# EAGLE design Garlic220 (EAGLE 9.3.0)
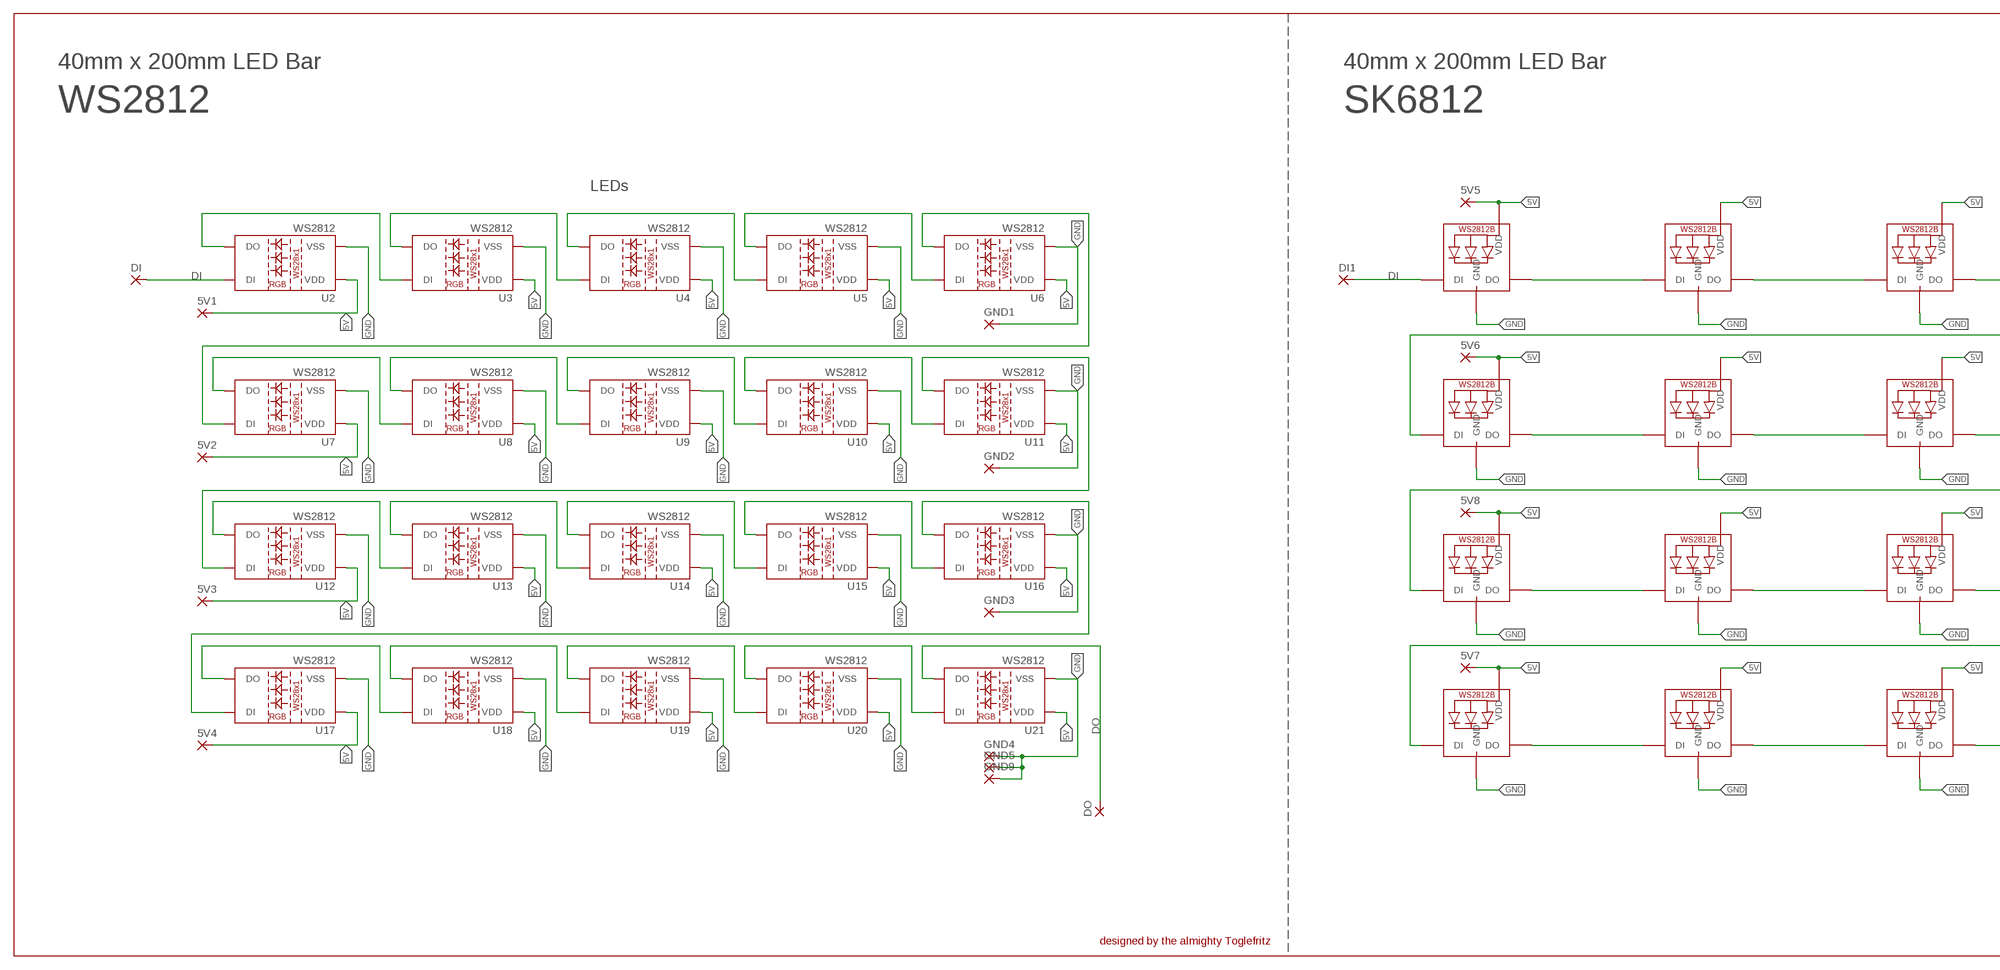
[diagram p0: schematic, sheet 1, part 1 of 2]
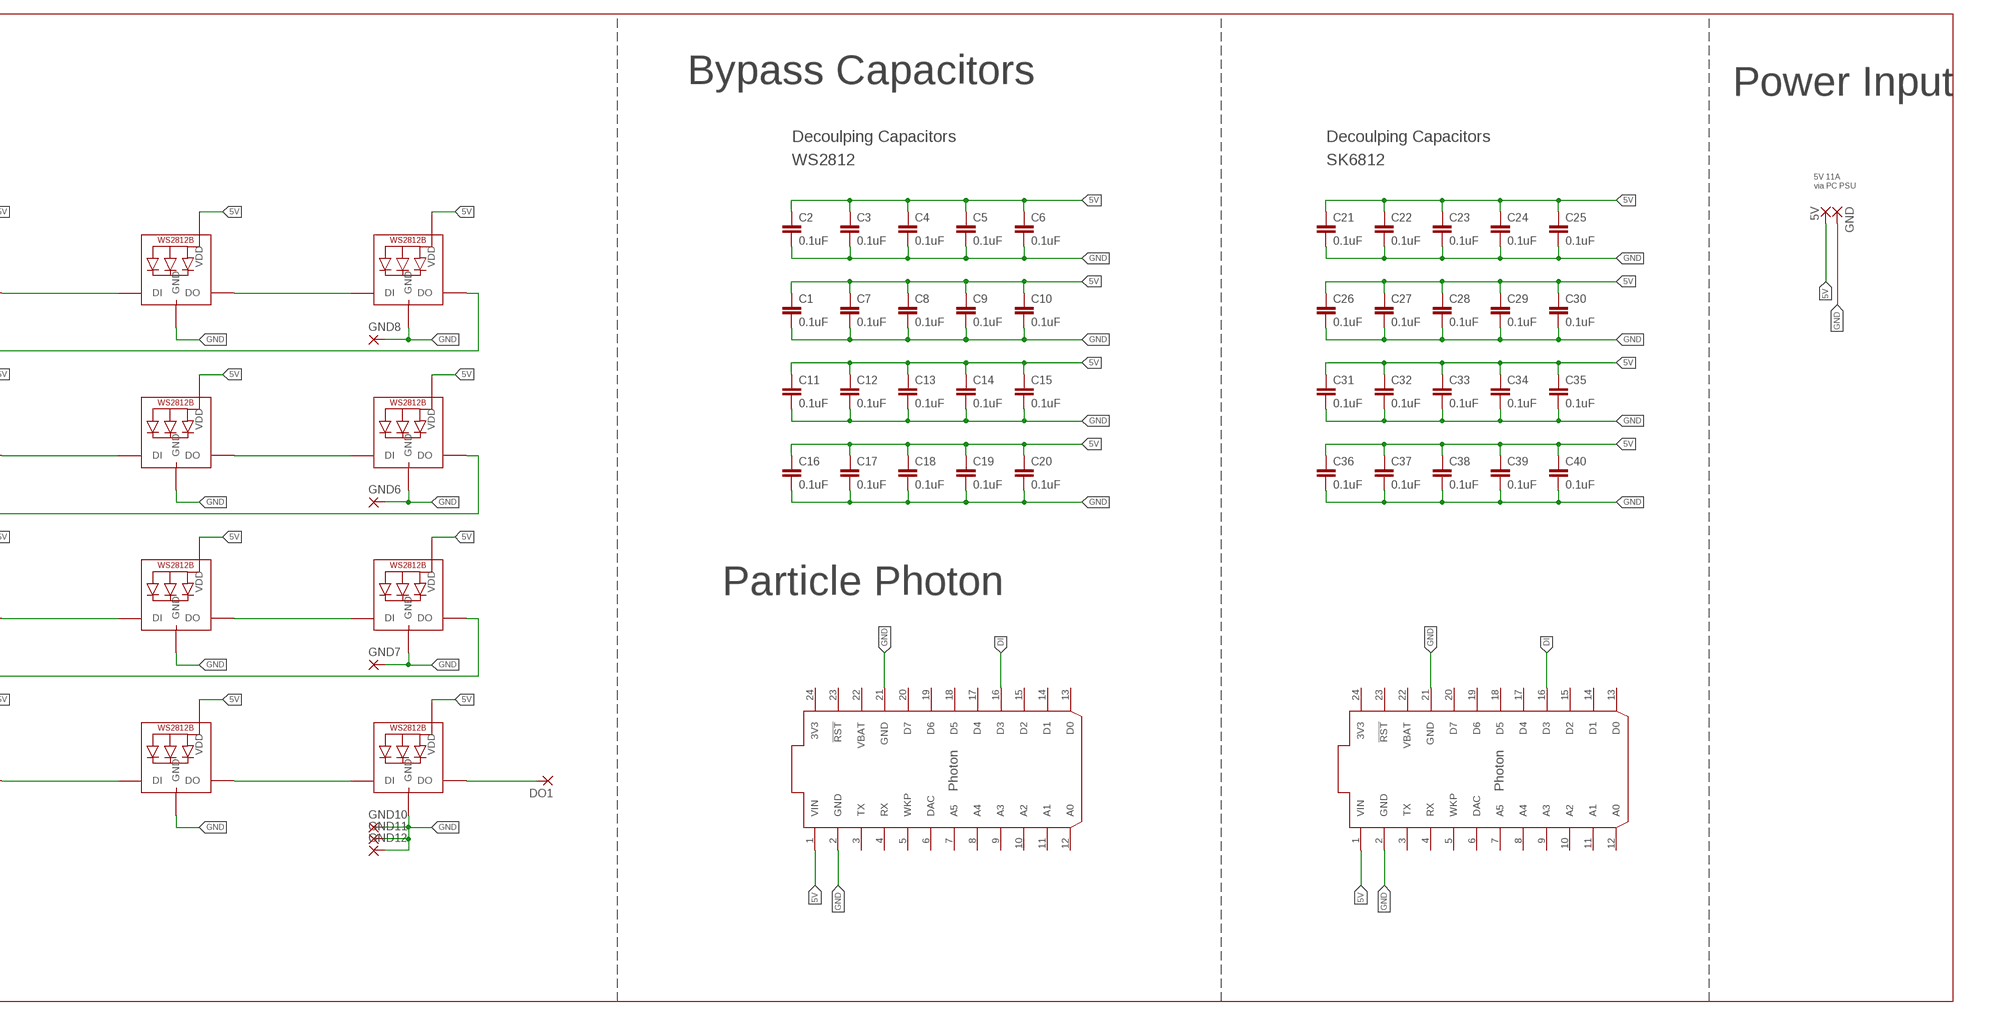
[diagram p1: schematic, sheet 1, part 2 of 2]

## Parts
5V  3,81/1,1  [3,81/1,1]
5V1  SMD5  [SMD2,54-5,08]
5V2  SMD5  [SMD2,54-5,08]
5V3  SMD5  [SMD2,54-5,08]
5V4  SMD5  [SMD2,54-5,08]
5V5  SMD5  [SMD2,54-5,08]
5V6  SMD5  [SMD2,54-5,08]
5V7  SMD5  [SMD2,54-5,08]
5V8  SMD5  [SMD2,54-5,08]
C1  0.1uF  1.0UF-0805-25V-(+80/-20%)  [0805]
C2  0.1uF  1.0UF-0805-25V-(+80/-20%)  [0805]
C3  0.1uF  1.0UF-0805-25V-(+80/-20%)  [0805]
C4  0.1uF  1.0UF-0805-25V-(+80/-20%)  [0805]
C5  0.1uF  1.0UF-0805-25V-(+80/-20%)  [0805]
C6  0.1uF  1.0UF-0805-25V-(+80/-20%)  [0805]
C7  0.1uF  1.0UF-0805-25V-(+80/-20%)  [0805]
C8  0.1uF  1.0UF-0805-25V-(+80/-20%)  [0805]
C9  0.1uF  1.0UF-0805-25V-(+80/-20%)  [0805]
C10  0.1uF  1.0UF-0805-25V-(+80/-20%)  [0805]
C11  0.1uF  1.0UF-0805-25V-(+80/-20%)  [0805]
C12  0.1uF  1.0UF-0805-25V-(+80/-20%)  [0805]
C13  0.1uF  1.0UF-0805-25V-(+80/-20%)  [0805]
C14  0.1uF  1.0UF-0805-25V-(+80/-20%)  [0805]
C15  0.1uF  1.0UF-0805-25V-(+80/-20%)  [0805]
C16  0.1uF  1.0UF-0805-25V-(+80/-20%)  [0805]
C17  0.1uF  1.0UF-0805-25V-(+80/-20%)  [0805]
C18  0.1uF  1.0UF-0805-25V-(+80/-20%)  [0805]
C19  0.1uF  1.0UF-0805-25V-(+80/-20%)  [0805]
C20  0.1uF  1.0UF-0805-25V-(+80/-20%)  [0805]
C21  0.1uF  1.0UF-0805-25V-(+80/-20%)  [0805]
C22  0.1uF  1.0UF-0805-25V-(+80/-20%)  [0805]
C23  0.1uF  1.0UF-0805-25V-(+80/-20%)  [0805]
C24  0.1uF  1.0UF-0805-25V-(+80/-20%)  [0805]
C25  0.1uF  1.0UF-0805-25V-(+80/-20%)  [0805]
C26  0.1uF  1.0UF-0805-25V-(+80/-20%)  [0805]
C27  0.1uF  1.0UF-0805-25V-(+80/-20%)  [0805]
C28  0.1uF  1.0UF-0805-25V-(+80/-20%)  [0805]
C29  0.1uF  1.0UF-0805-25V-(+80/-20%)  [0805]
C30  0.1uF  1.0UF-0805-25V-(+80/-20%)  [0805]
C31  0.1uF  1.0UF-0805-25V-(+80/-20%)  [0805]
C32  0.1uF  1.0UF-0805-25V-(+80/-20%)  [0805]
C33  0.1uF  1.0UF-0805-25V-(+80/-20%)  [0805]
C34  0.1uF  1.0UF-0805-25V-(+80/-20%)  [0805]
C35  0.1uF  1.0UF-0805-25V-(+80/-20%)  [0805]
C36  0.1uF  1.0UF-0805-25V-(+80/-20%)  [0805]
C37  0.1uF  1.0UF-0805-25V-(+80/-20%)  [0805]
C38  0.1uF  1.0UF-0805-25V-(+80/-20%)  [0805]
C39  0.1uF  1.0UF-0805-25V-(+80/-20%)  [0805]
C40  0.1uF  1.0UF-0805-25V-(+80/-20%)  [0805]
DI  SMD5  [SMD2,54-5,08]
DI1  SMD5  [SMD2,54-5,08]
DO  SMD5  [SMD2,54-5,08]
DO1  SMD5  [SMD2,54-5,08]
GND  3,81/1,1  [3,81/1,1]
GND1  SMD5  [SMD2,54-5,08]
GND2  SMD5  [SMD2,54-5,08]
GND3  SMD5  [SMD2,54-5,08]
GND4  SMD5  [SMD2,54-5,08]
GND5  SMD5  [SMD2,54-5,08]
GND6  SMD5  [SMD2,54-5,08]
GND7  SMD5  [SMD2,54-5,08]
GND8  SMD5  [SMD2,54-5,08]
GND9  SMD5  [SMD2,54-5,08]
GND10  SMD5  [SMD2,54-5,08]
GND11  SMD5  [SMD2,54-5,08]
GND12  SMD5  [SMD2,54-5,08]
LED21  WS2812B5050  [WS2812B]
LED22  WS2812B5050  [WS2812B]
LED23  WS2812B5050  [WS2812B]
LED24  WS2812B5050  [WS2812B]
LED25  WS2812B5050  [WS2812B]
LED26  WS2812B5050  [WS2812B]
LED27  WS2812B5050  [WS2812B]
LED28  WS2812B5050  [WS2812B]
LED29  WS2812B5050  [WS2812B]
LED30  WS2812B5050  [WS2812B]
LED31  WS2812B5050  [WS2812B]
LED32  WS2812B5050  [WS2812B]
LED33  WS2812B5050  [WS2812B]
LED34  WS2812B5050  [WS2812B]
LED35  WS2812B5050  [WS2812B]
LED36  WS2812B5050  [WS2812B]
LED37  WS2812B5050  [WS2812B]
LED38  WS2812B5050  [WS2812B]
LED39  WS2812B5050  [WS2812B]
LED40  WS2812B5050  [WS2812B]
U2  WS2812  WS2812"  [LED-TRICOLOR-5050-IC]
U3  WS2812  WS2812"  [LED-TRICOLOR-5050-IC]
U4  WS2812  WS2812"  [LED-TRICOLOR-5050-IC]
U5  WS2812  WS2812"  [LED-TRICOLOR-5050-IC]
U6  WS2812  WS2812"  [LED-TRICOLOR-5050-IC]
U7  WS2812  WS2812"  [LED-TRICOLOR-5050-IC]
U8  WS2812  WS2812"  [LED-TRICOLOR-5050-IC]
U9  WS2812  WS2812"  [LED-TRICOLOR-5050-IC]
U10  WS2812  WS2812"  [LED-TRICOLOR-5050-IC]
U11  WS2812  WS2812"  [LED-TRICOLOR-5050-IC]
U12  WS2812  WS2812"  [LED-TRICOLOR-5050-IC]
U13  WS2812  WS2812"  [LED-TRICOLOR-5050-IC]
U14  WS2812  WS2812"  [LED-TRICOLOR-5050-IC]
U15  WS2812  WS2812"  [LED-TRICOLOR-5050-IC]
U16  WS2812  WS2812"  [LED-TRICOLOR-5050-IC]
U17  WS2812  WS2812"  [LED-TRICOLOR-5050-IC]
U18  WS2812  WS2812"  [LED-TRICOLOR-5050-IC]
U19  WS2812  WS2812"  [LED-TRICOLOR-5050-IC]
U20  WS2812  WS2812"  [LED-TRICOLOR-5050-IC]
U21  WS2812  WS2812"  [LED-TRICOLOR-5050-IC]
U$1  PHOTON_SMD  [PHOTON_SMD]
U$2  PHOTON_SMD  [PHOTON_SMD]

## Nets
5V [power]: 5V1.1(P) 5V2.1(P) 5V3.1(P) 5V4.1(P) 5V5.1(P) 5V6.1(P) 5V7.1(P) 5V8.1(P) 5V.1(P) C1.1 C2.1 C3.1 C4.1 C5.1 C6.1 C7.1 C8.1 C9.1 C10.1 C11.1 C12.1 C13.1 C14.1 C15.1 C16.1 C17.1 C18.1 C19.1 C20.1 C21.1 C22.1 C23.1 C24.1 C25.1 C26.1 C27.1 C28.1 C29.1 C30.1 C31.1 C32.1 C33.1 C34.1 C35.1 C36.1 C37.1 C38.1 C39.1 C40.1 LED21.1-VDD(VDD) LED22.1-VDD(VDD) LED23.1-VDD(VDD) LED24.1-VDD(VDD) LED25.1-VDD(VDD) LED26.1-VDD(VDD) LED27.1-VDD(VDD) LED28.1-VDD(VDD) LED29.1-VDD(VDD) LED30.1-VDD(VDD) LED31.1-VDD(VDD) LED32.1-VDD(VDD) LED33.1-VDD(VDD) LED34.1-VDD(VDD) LED35.1-VDD(VDD) LED36.1-VDD(VDD) LED37.1-VDD(VDD) LED38.1-VDD(VDD) LED39.1-VDD(VDD) LED40.1-VDD(VDD) U2.3(VDD) U2.5(VDD) U3.3(VDD) U3.5(VDD) U4.3(VDD) U4.5(VDD) U5.3(VDD) U5.5(VDD) U6.3(VDD) U6.5(VDD) U7.3(VDD) U7.5(VDD) U8.3(VDD) U8.5(VDD) U9.3(VDD) U9.5(VDD) U10.3(VDD) U10.5(VDD) U11.3(VDD) U11.5(VDD) U12.3(VDD) U12.5(VDD) U13.3(VDD) U13.5(VDD) U14.3(VDD) U14.5(VDD) U15.3(VDD) U15.5(VDD) U16.3(VDD) U16.5(VDD) U17.3(VDD) U17.5(VDD) U18.3(VDD) U18.5(VDD) U19.3(VDD) U19.5(VDD) U20.3(VDD) U20.5(VDD) U21.3(VDD) U21.5(VDD) U$1.1(VIN) U$2.1(VIN)
DI: DI1.1(P) DI.1(P) LED21.4-DIN(DI) U2.2(DI) U$1.16(D3) U$2.16(D3)
DI1: U16.1(DO) U17.2(DI)
DO: DO.1(P) U21.1(DO)
GND [power]: C1.2 C2.2 C3.2 C4.2 C5.2 C6.2 C7.2 C8.2 C9.2 C10.2 C11.2 C12.2 C13.2 C14.2 C15.2 C16.2 C17.2 C18.2 C19.2 C20.2 C21.2 C22.2 C23.2 C24.2 C25.2 C26.2 C27.2 C28.2 C29.2 C30.2 C31.2 C32.2 C33.2 C34.2 C35.2 C36.2 C37.2 C38.2 C39.2 C40.2 GND1.1(P) GND2.1(P) GND3.1(P) GND4.1(P) GND5.1(P) GND6.1(P) GND7.1(P) GND8.1(P) GND9.1(P) GND10.1(P) GND11.1(P) GND12.1(P) GND.1(P) LED21.3-GND(GND) LED22.3-GND(GND) LED23.3-GND(GND) LED24.3-GND(GND) LED25.3-GND(GND) LED26.3-GND(GND) LED27.3-GND(GND) LED28.3-GND(GND) LED29.3-GND(GND) LED30.3-GND(GND) LED31.3-GND(GND) LED32.3-GND(GND) LED33.3-GND(GND) LED34.3-GND(GND) LED35.3-GND(GND) LED36.3-GND(GND) LED37.3-GND(GND) LED38.3-GND(GND) LED39.3-GND(GND) LED40.3-GND(GND) U2.6(VSS) U3.6(VSS) U4.6(VSS) U5.6(VSS) U6.6(VSS) U7.6(VSS) U8.6(VSS) U9.6(VSS) U10.6(VSS) U11.6(VSS) U12.6(VSS) U13.6(VSS) U14.6(VSS) U15.6(VSS) U16.6(VSS) U17.6(VSS) U18.6(VSS) U19.6(VSS) U20.6(VSS) U21.6(VSS) U$1.2(GND) U$1.21(GND) U$2.2(GND) U$2.21(GND)
N$1: U2.1(DO) U3.2(DI)
N$2: U3.1(DO) U4.2(DI)
N$3: U4.1(DO) U5.2(DI)
N$4: U7.1(DO) U8.2(DI)
N$5: U8.1(DO) U9.2(DI)
N$6: U9.1(DO) U10.2(DI)
N$7: U6.1(DO) U7.2(DI)
N$8: U12.1(DO) U13.2(DI)
N$9: U13.1(DO) U14.2(DI)
N$10: U14.1(DO) U15.2(DI)
N$11: U11.1(DO) U12.2(DI)
N$12: U5.1(DO) U6.2(DI)
N$13: U17.1(DO) U18.2(DI)
N$14: U15.1(DO) U16.2(DI)
N$15: U18.1(DO) U19.2(DI)
N$16: U10.1(DO) U11.2(DI)
N$17: U19.1(DO) U20.2(DI)
N$18: LED21.2-DOUT(DO) LED22.4-DIN(DI)
N$19: LED22.2-DOUT(DO) LED23.4-DIN(DI)
N$20: LED23.2-DOUT(DO) LED24.4-DIN(DI)
N$21: LED24.2-DOUT(DO) LED25.4-DIN(DI)
N$22: LED25.2-DOUT(DO) LED26.4-DIN(DI)
N$23: LED26.2-DOUT(DO) LED27.4-DIN(DI)
N$24: LED27.2-DOUT(DO) LED28.4-DIN(DI)
N$25: LED28.2-DOUT(DO) LED29.4-DIN(DI)
N$26: U20.1(DO) U21.2(DI)
N$27: LED29.2-DOUT(DO) LED30.4-DIN(DI)
N$28: LED30.2-DOUT(DO) LED31.4-DIN(DI)
N$29: LED31.2-DOUT(DO) LED32.4-DIN(DI)
N$30: LED32.2-DOUT(DO) LED33.4-DIN(DI)
N$31: LED33.2-DOUT(DO) LED34.4-DIN(DI)
N$32: LED34.2-DOUT(DO) LED35.4-DIN(DI)
N$33: LED35.2-DOUT(DO) LED36.4-DIN(DI)
N$34: LED36.2-DOUT(DO) LED37.4-DIN(DI)
N$35: LED37.2-DOUT(DO) LED38.4-DIN(DI)
N$36: LED38.2-DOUT(DO) LED39.4-DIN(DI)
N$37: LED39.2-DOUT(DO) LED40.4-DIN(DI)
N$38: DO1.1(P) LED40.2-DOUT(DO)
Unconnected: U$1.3(TX) U$1.4(RX) U$1.5(WKP) U$1.6(DAC) U$1.7(A5) U$1.8(A4) U$1.9(A3) U$1.10(A2) U$1.11(A1) U$1.12(A0) U$1.13(D0) U$1.14(D1) U$1.15(D2) U$1.17(D4) U$1.18(D5) U$1.19(D6) U$1.20(D7) U$1.23(!RST) U$1.25(EN) U$1.26(!SETUP) U$1.27(RGB_RED) U$1.28(RGB_GREEN) U$1.29(RGB_BLUE) U$1.30(USB_D-) U$1.31(USB_D+) U$2.3(TX) U$2.4(RX) U$2.5(WKP) U$2.6(DAC) U$2.7(A5) U$2.8(A4) U$2.9(A3) U$2.10(A2) U$2.11(A1) U$2.12(A0) U$2.13(D0) U$2.14(D1) U$2.15(D2) U$2.17(D4) U$2.18(D5) U$2.19(D6) U$2.20(D7) U$2.23(!RST) U$2.25(EN) U$2.26(!SETUP) U$2.27(RGB_RED) U$2.28(RGB_GREEN) U$2.29(RGB_BLUE) U$2.30(USB_D-) U$2.31(USB_D+)

## Notes on the sheet
- 40mm x 200mm LED Bar | 40mm x 200mm LED Bar
- Bypass Capacitors | Power Input
- WS2812 | SK6812
- Decoulping Capacitors | Decoulping Capacitors
- WS2812 | SK6812
- 5V 11A 
  via PC PSU
- LEDs
- Particle Photon
- designed by the almighty Toglefritz

## Power pins joined to a net without a drawn wire
3V3: U$1.24(3V3) U$2.24(3V3)
VBAT: U$1.22(VBAT) U$2.22(VBAT)

## Library data of the parts
5V GND = wirepad:3,81/1,1: THROUGH-HOLE PAD
5V1-5V8 DI DI1 DO DO1 GND1-GND12 = wirepad:SMD5: SMD PAD
C1-C40 = SparkFun-Capacitors:1.0UF: 1µF ceramic capacitors A capacitor is a passive two-terminal electrical component used to store electrical energy temporarily in an electric field.; PROD_ID: CAP-11625; VALUE: 1.0uF
LED21-LED40 = adafruit:WS2812B
U2-U21 = SparkFun-LED:WS2812: WS2812 RGB LED w/ WS2811 driver 5x5mm SMD LED with built-in controller IC. Color: Red/Green/Blue mC Rating: RGB: 550, 1100, 200 mcd Current:RGB: 20, 20, 20 mA Forward Voltage: RGB: 1.8, 3.0, 3.2 V Packages:LED-TRICOLOR-5050-IC SparkFun Products: LED-SMD RGB (WS2812) <https://www.sparkfun.com/products/11821>; PROD_ID: DIO-11598
U$1 U$2 = Particle-Devices:PHOTON_SMD: Particle Photon (without headers) WiFi development board footprint - designed to be surface mounted with 7 extra exposed pads on the bottom of the board which include, 3 RGB LED outputs, /SETUP, EN (3.3V SMPS enable input), USB D+ and USB D-. Product datasheet: here <https://docs.particle.io/datasheets/photon-(wifi)/photon-datasheet/> Design files: here <https://github.com/particle-iot/photon> Github : Particle devices library <https://github.com/particle-iot/hardware-libraries/tree/master/Eagle>

## Net classes
1 power: width 1 mm

## Board
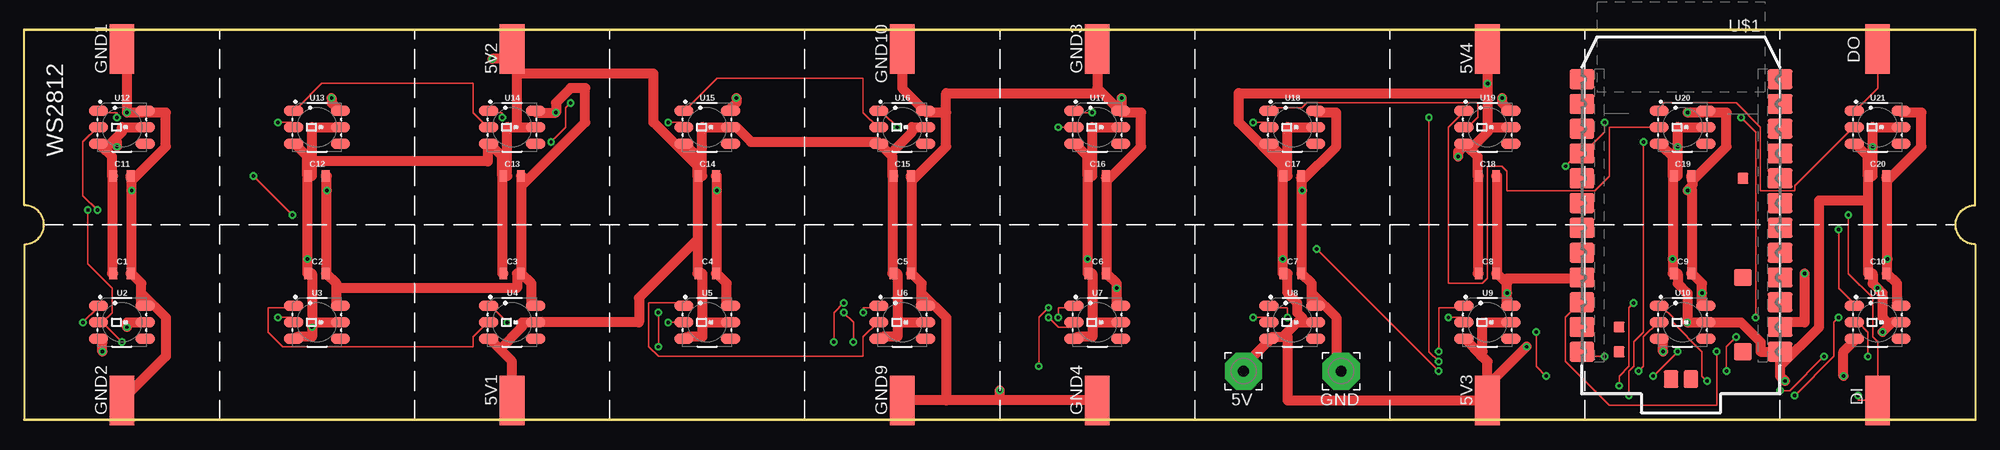
[diagram p2: board, top side]
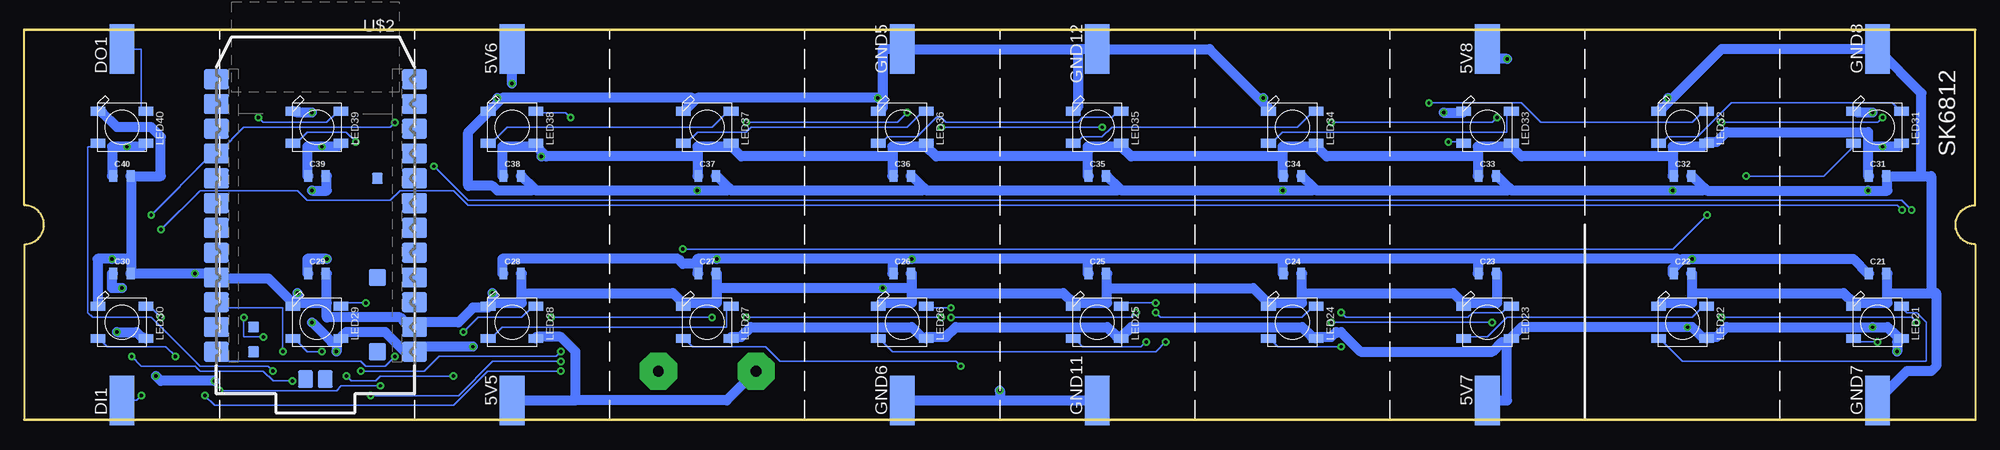
[diagram p3: board, bottom side, seen from below]

Size 200 x 40 mm. Coordinates in mm from the lower left corner, seen from the top.
Outline: 0,0 200,0 200,18 arc-180 200,22 200,40 0,40 0,22 arc-180 0,18 0,0
Copper layers (1+2*15+16): Top 0.035mm / dielectric 1.5mm / layer 2 0.035mm / dielectric 0.15mm / layer 15 0.035mm / dielectric 0.2mm / Bottom 0.035mm
Design rules "default *": minimum track width 6mil, minimum drill 0.35mm, track to track 6mil, track to pad 6mil, pad to pad 6mil, via to via 6mil, smd to smd 6mil, copper to edge 40mil, drill to drill 6mil, minimum pad ring 10mil, minimum via ring 8mil, stop-mask expansion 4mil, vias tented up to drill 0mil, thermal gap 10mil

### Footprints (pad centres in the part's own frame; a part is rotated, then mirrored left to right if it is on the bottom)
3,81/1,1 = drill 1.118 pad 3.81 octagon: 1 0,0
SMD2,54-5,08 = smd 2.54 x 5.08: 1 0,0
0805 = smd 0.8 x 1.2: 1 -0.9,0; 2 0.9,0
WS2812B = smd 1.5 x 0.9: 1-VDD 2.45,-1.65; 2-DOUT 2.45,1.65; 3-GND -2.45,1.65; 4-DIN -2.45,-1.65
LED-TRICOLOR-5050-IC = smd 2 x 1.1: 1 -2.4,1.7; 2 -2.4,0; 3 -2.4,-1.7; 4 2.4,-1.7; 5 2.4,0; 6 2.4,1.7
PHOTON_SMD = smd 2.54 x 2.032: 1 0,33.02; 2 0,30.48; 3 0,27.94; 4 0,25.4; 5 0,22.86; 6 0,20.32; 7 0,17.78; 8 0,15.24; 9 0,12.7; 10 0,10.16; 11 0,7.62; 12 0,5.08; 13 20.32,5.08; 14 20.32,7.62; 15 20.32,10.16; 16 20.32,12.7; 17 20.32,15.24; 18 20.32,17.78; 19 20.32,20.32; 20 20.32,22.86; 21 20.32,25.4; 22 20.32,27.94; 23 20.32,30.48; 24 20.32,33.02 | smd 1.778 x 1.778: 25 3.81,33.02; 26 3.81,25.4 | smd 1.143 x 1.143: 27 3.81,15.24; 28 16.51,30.48; 29 16.51,33.02 | smd 1.524 x 1.778: 30 11.176,35.814; 31 9.144,35.814

### Placement (x,y rotation side)
5V  125,5 180 top
5V1  50,2 0 top
5V2  50,38 0 top
5V3  150,2 0 top
5V4  150,38 0 top
5V5  150,2 0 bottom
5V6  150,38 0 bottom
5V7  50,2 0 bottom
5V8  50,38 0 bottom
C1  10,15 0 top
C2  30,15 0 top
C3  50,15 0 top
C4  70,15 0 top
C5  90,15 0 top
C6  110,15 0 top
C7  130,15 0 top
C8  150,15 0 top
C9  170,15 0 top
C10  190,15 0 top
C11  10,25 0 top
C12  30,25 0 top
C13  50,25 0 top
C14  70,25 0 top
C15  90,25 0 top
C16  110,25 0 top
C17  130,25 0 top
C18  150,25 0 top
C19  170,25 0 top
C20  190,25 0 top
C21  10,15 0 bottom
C22  30,15 0 bottom
C23  50,15 0 bottom
C24  70,15 0 bottom
C25  90,15 0 bottom
C26  110,15 0 bottom
C27  130,15 0 bottom
C28  150,15 0 bottom
C29  170,15 0 bottom
C30  190,15 0 bottom
C31  10,25 0 bottom
C32  30,25 0 bottom
C33  50,25 0 bottom
C34  70,25 0 bottom
C35  90,25 0 bottom
C36  110,25 0 bottom
C37  130,25 0 bottom
C38  150,25 0 bottom
C39  170,25 0 bottom
C40  190,25 0 bottom
DI  190,2 0 top
DI1  190,2 0 bottom
DO  190,38 0 top
DO1  190,38 0 bottom
GND  135,5 180 top
GND1  10,38 0 top
GND2  10,2 0 top
GND3  110,38 0 top
GND4  110,2 0 top
GND5  110,38 0 bottom
GND6  110,2 0 bottom
GND7  10,2 0 bottom
GND8  10,38 0 bottom
GND9  90,2 0 top
GND10  90,38 0 top
GND11  90,2 0 bottom
GND12  90,38 0 bottom
LED21  10,10 0 bottom
LED22  30,10 0 bottom
LED23  50,10 0 bottom
LED24  70,10 0 bottom
LED25  90,10 0 bottom
LED26  110,10 0 bottom
LED27  130,10 0 bottom
LED28  150,10 0 bottom
LED29  170,10 0 bottom
LED30  190,10 0 bottom
LED31  10,30 0 bottom
LED32  30,30 0 bottom
LED33  50,30 0 bottom
LED34  70,30 0 bottom
LED35  90,30 0 bottom
LED36  110,30 0 bottom
LED37  130,30 0 bottom
LED38  150,30 0 bottom
LED39  170,30 0 bottom
LED40  190,30 0 bottom
U2  10,10 0 top
U3  30,10 0 top
U4  50,10 0 top
U5  70,10 0 top
U6  90,10 0 top
U7  110,10 0 top
U8  130,10 0 top
U9  150,10 0 top
U10  170,10 0 top
U11  190,10 0 top
U12  10,30 0 top
U13  30,30 0 top
U14  50,30 0 top
U15  70,30 0 top
U16  90,30 0 top
U17  110,30 0 top
U18  130,30 0 top
U19  150,30 0 top
U20  170,30 0 top
U21  190,30 0 top
U$1  180,40 180 top
U$2  160,40 180 bottom

### Tracks (layer width: path | path; a pad name or v marks a point on that pad's centre or on a via)
3V3  (via drill 0.35)
  Top 0.152: v162,6.5 160,6.5 U$1.24
  Bottom 0.152: v162,6.5 163,5.5 165,5.5 165.5,6 179.5,6 180,6.5 U$2.24
5V  (via drill 0.35)
  Top 1: v8,7 8,8 U2.3 | U2.5 10.5,10 v10.5,9.5 | 29,25 v29,16.5 29,15 C2.1 29.5,15 29.5,10 | 29.5,10 v29.5,9.5 29.5,8.5 28,8.5 U3.3 | 29.5,10 U3.5 | 29,25 29,27 28,28 U13.3 | 29,25 C12.1 29.5,25 29.5,26.5 | U13.5 29.5,30 29.5,26.5 | 50,37 v48,37 | 49,25 49,15 C3.1 | 49,25 49,27 48,28 U14.3 47.5,28 47.5,26.5 29.5,26.5 | 49,25 C13.1 49.5,25 49.5,30 50.5,30 | 50.5,30 U14.5 | 50,37 50.5,36.5 50.5,35.5 | 50.5,30 50.5,35.5 | 50,37 5V8.1 50.5,35.5 | 89,25 89,15 C5.1 89.5,15 89.5,10 | 89.5,10 89.5,8.5 88,8.5 U6.3 | 89.5,10 U6.5 | 88.75,27.25 89,27 89,25 | 88.75,27.25 88,28 U16.3 87.5,28.5 74.5,28.5 73,30 U15.5 69.5,30 69.5,25 C14.1 69,25 | 89,25 C15.1 | U16.5 91,30 91,29.5 88.75,27.25 | 48.75,7.25 50,6 5V7.1 | 48.75,7.25 48,8 U4.3 | 48.75,7.25 51,9.5 51,10 U4.5 63,10 63,12.5 69,18.5 | 69,25 69,18.5 | 69,18.5 69,15 C4.1 69.5,15 69.5,10 | 69.5,10 69.5,8.5 68,8.5 U5.3 | 69.5,10 U5.5 | 69,25 69,26 | 69,26 69,27 68,28 U15.3 | 50.5,35.5 64.5,35.5 64.5,30.5 69,26 | 109,25 v109,16.5 109,15 C6.1 109.5,15 109.5,10 | 109.5,10 109.5,8.5 108,8.5 U7.3 | 109.5,10 U7.5 | 109,25 109,27 108,28 U17.3 | 109,25 C16.1 109.5,25 109.5,30 U17.5 | 191.25,9.75 191.5,10 U11.5 | 191.25,9.75 v190.5,9 | 189,25 189,22.5 | 189,22.5 189,15 C10.1 189.5,15 189.5,14 v190,13.5 190.5,13 190.5,10.5 191.25,9.75 | 189,25 189,27 188,28 U21.3 | 189,25 C20.1 189.5,25 v189.5,28 189.5,30 U21.5 | v186.5,4.5 186.5,7 187.5,8 U11.3 | v180.5,4 180,4.5 180,5.5 | 180,5.5 U$1.1 180,7 178,7 178,8 176,10 U10.5 v170.5,10 170.5,13 169.5,14 169.5,15 C9.1 169,15 v169,16.5 169,25 | v168,7 168,8 U10.3 | 169,25 169,27 168,28 U20.3 | 169,25 C19.1 169.5,25 v169.5,28 169.5,30 U20.5 | 189,22.5 184,22.5 184,9.5 180,5.5
  Top 1: 149,25 149,15 C8.1 | 149,25 149,27 148,28 U19.3 | 149,25 C18.1 | 150,30 U19.5 | 5V6.1 v150,34.5 150,33.5 | 150,33.5 150,30 | 150,30 150,29.5 148.5,28 U19.3 | 129,25 v129,16.5 129,15 C7.1 129.5,15 129.5,13 130.5,12 130.5,11 131,10.5 131,10 | 129,25 129,26 | 129,26 129,27 128,28 U18.3 | 129,25 C17.1 129.5,25 129.5,30 U18.5 | 149.25,6.75 150,6 150,3.5 | 149.25,6.75 148,8 U9.3 | U9.5 149.5,10 149.5,7 149.25,6.75 | 5V.1 125,5.5 127.5,8 U8.3 128,8.5 129,8.5 129.25,8.75 | 131,10 130.5,10 129.25,8.75 | 131,10 U8.5 | 129.25,8.75 129.5,8.5 129.5,2 5V5.1 150,3.5 | 150,33.5 124.5,33.5 124.5,30.5 129,26 | 150,3.5 v154,7.5 | 9,25 9,15 C1.1 | 9,25 9,27 8,28 U12.3 8.5,28 9.25,28.75 | 9,25 C11.1 | U12.5 10,30 10,29.5 9.25,28.75 | v9.5,28 9.5,28.5 9.25,28.75 | v147,27 147,27.5 147.5,28 U19.3
  Bottom 1: 48,8 48,2 5V7.1 | 48,8 LED23.1-VDD 47.5,8.5 46.5,9.5 v29.5,9.5 29,9.5 28,8.5 LED22.1-VDD 27.5,8.5 26.5,8.5 25.5,9.5 v10.5,9.5 9,9.5 8,8.5 LED21.1-VDD 8,8 v8,7 | LED27.1-VDD 127.5,8.5 126.5,8.5 125.5,9.5 109,9.5 108,8.5 LED26.1-VDD 107.5,8.5 105.5,8.5 104.5,9.5 89,9.5 88,8.5 LED25.1-VDD 87.5,8.5 86.5,9.5 69,9.5 68,8.5 LED24.1-VDD 67.5,8.5 66,8.5 65.5,9 65,9 63,7 49.5,7 48.5,8 48,8 | 5V8.1 49,37 v48,37 | 30.25,16.25 31,15.5 31,15 C22.1 | 30.25,16.25 30,16.5 v29,16.5 12.5,16.5 11,15 C21.1 | 51,16.5 51,15 C23.1 | 51,16.5 30.5,16.5 30.25,16.25 | 71,16.5 71,15 C24.1 | 51,16.5 71,16.5 | 91,16.5 91,15 C25.1 | 71,16.5 91,16.5 | 111,16.5 111,15 C26.1 | 91,16.5 v109,16.5 111,16.5 | 131,16 131,16.5 v129,16.5 111,16.5 | 131,16 131,15 C27.1 | 131,16 132.5,16 133,16.5 151,16.5 151,15 C28.1 | v190.5,9 188.5,9 188,8.5 LED30.1-VDD | C40.1 191,25 191,28 v189.5,28 188,28 LED40.1-VDD | v190,13.5 191,13.5 191,15 C30.1 | v186.5,4.5 186,4 v180.5,4 | 160,7 161,7 163,9 167,9 167.5,8.5 LED29.1-VDD 168,8 | 168,8 v168,7 | C39.1 171,25 171,28 v169.5,28 168,28 LED39.1-VDD | v169,16.5 171,16.5 171,15 C29.1 | v170.5,10 168.5,8 168,8 | v150,34.5 5V6.1 | 143.5,2 143.5,7 145,8.5 147.5,8.5 LED28.1-VDD | 5V5.1 143.5,2 | 143.5,2 128,2 5V.1 | 160,7 159.5,7.5 v154,7.5 | 160,7 U$2.1 | C38.1 151,25 151,28 148,28 LED38.1-VDD 147.5,28 146.75,27.25 | 131,27 131,28 128,28 LED37.1-VDD 127.5,28 126.5,27 111,27 | 131,27 131,25 C37.1 | 111,27 111,28 108,28 LED36.1-VDD 107.5,28 106.5,27 91,27 | 111,27 111,25 C36.1 | 91,27 91,28 88,28 LED35.1-VDD 87.5,28 86.5,27 71,27 | 91,27 91,25 C35.1 | 71,27 71,28 68,28 LED34.1-VDD 67.5,28 66.5,27 51,27 | 71,27 71,25 C34.1
  Bottom 1: 51,27 51,28 48,28 LED33.1-VDD 47.5,28 46.5,27 31,27 | 51,27 51,25 C33.1 | 11,28 11,25 C31.1 | 11,28 v9.5,28 8,28 LED31.1-VDD | 31,27 31,28 28,28 LED32.1-VDD 27.5,28.5 26.5,28.5 25.5,29.5 11,29.5 11,28 | 31,27 31,25 C32.1 | 146.75,27.25 146.5,27 131,27 | v147,27 146.75,27.25
DI  (via drill 0.35)
  Top 0.152: v188,2.5 188,2 DI1.1 190,8 189.5,8.5 189.5,12.5 187,15 v187,21 | 8,10 v10,8 | v162,30.5 162,29.5 160,27.5 U$1.16 159.5,27.5 v158,26 | 8,10 9,11 9,13.5 6.5,16 v6.5,21.5 | 8,10 U2.2
  Bottom 0.152: v188,2.5 188.5,2 DI1.1 | v10,8 12,8 LED21.4-DIN | v162,30.5 162.5,30 177.5,30 180,27.5 U$2.16 180.5,27 181,27 v187,21 | v6.5,21.5 7.5,22.5 154.5,22.5 v158,26
DI1  (via drill 0.35)
  Top 0.152: v89.5,30 88,31.5 U16.1 | U17.2 v106,30
  Bottom 0.152: v106,30 v89.5,30
DO
  Top 0.152: DO.1 190,34 188,32 U21.1
GND  (via drill 0.35)
  Top 1: 110.25,33.75 110,34 GND5.1 | 110.25,33.75 112,32 U17.6 | 111,15 112,14 v112,13.5 112,12 U7.6 | 111,15 111,24.5 | 111,24.5 111,25 C16.2 111,24.5 | 111,15 C6.2 | 111,24.5 114.5,28 114.5,31.5 112.5,31.5 U17.6 | GND6.1 100,2 | 100,2 94.5,2 | 94.5,2 GND11.1 | 100,2 v100,3 | GND12.1 90,34 92,32 U16.6 92.5,31.5 94.5,31.5 | 91,15 92,14 92,13 | 92,13 92,12 U6.6 | 91,15 91,24.5 | 91,24.5 91,25 C15.2 91,24.5 | 91,15 C5.2 | 94.5,31.5 94.5,28 91,24.5 | 94.5,2 94.5,10.5 92,13 | 94.5,31.5 94.5,33.5 110,33.5 110.25,33.75 | v170.5,31.5 172,31.5 U20.6 172.5,31.5 174.5,31.5 174.5,28 171,24.5 | 170.75,23.75 171,24 171,24.5 | 170.75,23.75 v170.5,23.5 | 171,24.5 171,25 C19.2 171,24.5 | 171,15 172,14 v172,13 172,12 U10.6 | 171,15 171,23.5 170.75,23.75 | 171,15 C9.2 | 191,15 192,14 192,12 U11.6 | 191,15 v191,16.5 191,24.5 | 191,24.5 191,25 C20.2 191,24.5 | 191,15 C10.2 | 191,24.5 194.5,28 194.5,31.5 192.5,31.5 U21.6 | v182.5,15 182.5,10 180,10 U$1.2 | 151.75,14.25 152,14 v152,13 152,12 U9.6 | 151.75,14.25 151,15 | 151,15 151,25 C18.2 | 151,15 C8.2 | U$1.21 159.5,14.5 152,14.5 151.75,14.25 | v73,33 73,32.5 72.5,32 U15.6 | v151.5,33 151.5,32.5 152,32 U19.6 | GND8.1 10.5,37.5 v10.5,31.5 12,31.5 U12.6 12.5,31.5 14.5,31.5 14.5,28 11,24.5 | 11,15 12,14 12,13 | 12,13 12,12 U2.6 | 11,15 v11,23.5 11,24.5 | 11,24.5 11,25 C11.2 11,24.5 | 11,15 C1.2 | GND7.1 14.5,6.5 14.5,10.5 12,13 | 31,15 32,14 32,13.5 | 32,13.5 32,12 U3.6 | 31,15 v31,23.5 31,25 C12.2 | 31,15 C2.2 | U14.6 52.5,31.5 v54.5,31.5 54.5,32.5 56,34 57.5,34 57.5,30.5 51,24 | 51,15 52,14 52,12 U4.6 | 51,15 51,24 | 51,24 51,25 C13.2 | 51,15 C3.2 50.5,15 50.5,13.5 32,13.5 | 131,15 132,14 132,13 | 132,13 132,12 U8.6 | 131,15 v131,23.5 131,24.5
  Top 1: 131,24.5 131,25 C17.2 131,24.5 | 131,15 C7.2 | 131,24.5 134.5,28 134.5,31.5 132.5,31.5 U18.6 | GND.1 134.5,5.5 134.5,10.5 132,13 | v31.5,33 31.5,32.5 32,32 U13.6 | 71,15 72,14 72,12 U5.6 | 71,15 v71,23.5 71,25 C14.2 | 71,15 C4.2 | v112.5,33 112.5,32 U17.6
  Bottom 1: GND6.1 100,2 | 100,2 GND11.1 | v100,3 100,2 | v170.5,31.5 172,31.5 LED39.3-GND | v170.5,23.5 169,23.5 169,25 C39.2 | 169,12 169,15 C29.2 | 172,12 169,12 | 172,12 LED29.3-GND 172.5,12 175,14.5 180,14.5 U$2.21 180.5,15 v182.5,15 189,15 | 189,15 189,16.5 | 189,16.5 189,25 | 189,15 C30.2 | 189,16.5 v191,16.5 192.5,16.5 192.5,12 LED30.3-GND | 189,25 186,25 186,29 187,30 190.5,30 192,31.5 LED40.3-GND | 189,25 C40.2 | v172,13 172,12 | 129,13.5 129,12 132,12 LED27.3-GND 132.5,12 133.5,13 149,13 | 129,13.5 129,15 C27.2 | 149,13 149,12 152,12 | 149,13 149,15 C28.2 | 152,12 LED28.3-GND 152.5,11.5 154,11.5 155.5,10 160,10 | v152,13 152,12 | C23.2 49,15 49,12 52,12 LED23.3-GND 52.5,12 53.5,13 69,13 | 69,13 69,12 72,12 LED24.3-GND 72.5,12 74,13.5 89,13.5 | 69,13 69,15 C24.2 | 89,13.5 89,12 92,12 LED25.3-GND 92.5,12 93.5,13 109,13 | 89,13.5 89,15 C25.2 | 109,13 109,12 112,12 LED26.3-GND | 109,13 109,13.5 | 109,13.5 109,15 C26.2 | 109,13.5 v112,13.5 129,13.5 | 169,12 169,10.5 161.5,10.5 161,10 160,10 | 160,10 U$2.2 | 73.25,32.75 78.5,38 GND12.1 92,38 | 73.25,32.75 72.5,32 LED34.3-GND | 92,38 92,32 LED35.3-GND | v73,33 73.25,32.75 | 112,33 112,38 GND5.1 92,38 | 112,33 112,32 LED36.3-GND | 131.25,32.75 131,33 v112.5,33 112,33 | 131.25,32.75 132,32 LED37.3-GND | 151.25,32.75 151,33 131.5,33 131.25,32.75 | 151.25,32.75 152,32 LED38.3-GND 152.5,31.5 154.5,29.5 154.5,24 152,24 151.5,23.5 148,23.5 147.75,23.75 | v151.5,33 151.25,32.75 | v10.5,31.5 12,31.5 LED31.3-GND | v54.5,31.5 52.5,31.5 LED33.3-GND | 9,13 9,12 12,12 LED21.3-GND 12.5,12 13.5,13 29,13 | 9,13 9,15 C21.2 | 29,13 29,12 32,12 LED22.3-GND | 29,13 29,15 C22.2 | GND7.1 7,5 4.5,5 4,5.5 4,13 4.5,13
  Bottom 1: 9,13 4.5,13 | 31.25,32.75 26,38 GND8.1 5.5,33.5 5.5,25 | 31.25,32.75 32,32 LED32.3-GND | v31.5,33 31.25,32.75 | 9,25 9,23.5 v11,23.5 27.5,23.5 27.75,23.75 | 27.75,23.75 29,25 C32.2 | 47.75,23.75 47.5,23.5 v31,23.5 28,23.5 27.75,23.75 | 47.75,23.75 49,25 C33.2 | 67.75,23.75 67.5,23.5 48,23.5 47.75,23.75 | 67.75,23.75 69,25 C34.2 | 87.75,23.75 87.5,23.5 v71,23.5 68,23.5 67.75,23.75 | 87.75,23.75 89,25 C35.2 | 107.75,23.75 107.5,23.5 88,23.5 87.75,23.75 | 107.75,23.75 109,25 C36.2 | 127.75,23.75 127.5,23.5 108,23.5 107.75,23.75 | 127.75,23.75 129,25 C37.2 | 147.75,23.75 147.5,23.5 v131,23.5 128,23.5 127.75,23.75 | 147.75,23.75 149,25 C38.2 | 9,25 5.5,25 | 9,25 C31.2 | 4.5,13 4.5,25 5.5,25
N$1  (via drill 0.35)
  Top 0.152: v6,10 7.5,11.5 U2.1 | v26,10.5 27.5,10.5 27.5,10 U3.2
  Bottom 0.152: v6,10 6.5,10.5 v26,10.5
N$2
  Top 0.152: U3.1 27.5,11.5 25,11.5 25,9 26.5,7.5 46,7.5 46,8.5 47.5,10 U4.2
N$3  (via drill 0.35)
  Top 0.152: v49.5,10 48,11.5 U4.1 | U5.2 v66,10
  Bottom 0.152: v66,10 v49.5,10
N$4  (via drill 0.35)
  Top 0.152: v106,10.5 106,11.5 107.5,11.5 U7.1 | v126,10.5 127.5,10.5 127.5,10 U8.2
  Bottom 0.152: v126,10.5 v106,10.5
N$5  (via drill 0.35)
  Top 0.152: v129.5,10.5 129.5,11.5 128,11.5 U8.1 | v146,10.5 147.5,10.5 147.5,10 U9.2
  Bottom 0.152: v146,10.5 v129.5,10.5
N$6  (via drill 0.35)
  Top 0.152: v145,7 145,11.5 147.5,11.5 U9.1 | v165.5,5 166,5.5 166,8.5 167.5,10 U10.2
  Bottom 0.152: v145,7 145.5,6.5 157.5,6.5 159,5 v165.5,5
N$7  (via drill 0.35)
  Top 0.152: v86,11 86,11.5 87.5,11.5 U6.1 | v105,10.5 106,9.5 107.5,9.5 107.5,10 U7.2
  Bottom 0.152: v86,11 86.5,10.5 v105,10.5
N$8  (via drill 0.35)
  Top 0.152: v9.5,31 9.5,31.5 8,31.5 U12.1 | v26,30.5 27.5,30.5 27.5,30 U13.2
  Bottom 0.152: v9.5,31 10,30.5 v26,30.5
N$9
  Top 0.152: U13.1 28,32 30.5,34.5 46,34.5 46,31.5 47.5,30 U14.2
N$10  (via drill 0.35)
  Top 0.152: v49,31 49,31.5 48,31.5 U14.1 | v66,30.5 67.5,30.5 67.5,30 U15.2
  Bottom 0.152: v49,31 49.5,30.5 v66,30.5
N$11  (via drill 0.35)
  Top 0.152: v186,19.5 186,13.5 187.5,12 U11.1 | v7.5,21.5 6,23 6,28.5 7.5,30 U12.2
  Bottom 0.152: v186,19.5 182,23.5 172,23.5 171,22.5 162.5,22.5 161.5,23.5 156,23.5 154.5,22 8,22 v7.5,21.5
N$12
  Top 0.152: U5.1 67.5,12 64,12 64,7.5 65,6.5 86,6.5 86,8.5 87.5,10 U6.2
N$13  (via drill 0.35)
  Top 0.152: v109.5,31.5 108,31.5 U17.1 | v126,30.5 127.5,30.5 127.5,30 U18.2
  Bottom 0.152: v109.5,31.5 110.5,30.5 v126,30.5
N$14
  Top 0.152: U15.1 68,32 71,35 86,35 86,31.5 87.5,30 U16.2
N$15
  Top 0.152: U18.1 128,32 131,32 131.5,32.5 149,32.5 149,31 148,30 U19.2
N$16  (via drill 0.35)
  Top 0.152: v189,6.5 189,9 188,10 U11.2 | v172.5,4 172,4.5 172,7 169,10 169,10.5 168,11.5 U10.1
  Bottom 0.152: v189,6.5 188,5.5 182.5,5.5 182,5 175.5,5 174.5,4 v172.5,4
N$17
  Top 0.152: U20.2 162.5,30 162.5,25 161,23.5 152,23.5 152,25.5 151.5,26 150,26 150,14.5 149.5,14 146,14 146,30 147.5,31.5 U19.1
N$18
  Bottom 0.152: LED21.2-DOUT 7.5,11.5 7,11 6,11 5,10 5,6 30,6 32,8 LED22.4-DIN
N$19
  Bottom 0.152: LED22.2-DOUT 28,11.5 29,10.5 48,10.5 50,8.5 52,8.5 LED23.4-DIN
N$20  (via drill 0.35)
  Top 0.152: v65,7.5 v65,11
  Bottom 0.152: v65,11 64.5,10.5 52,10.5 51.5,11 48.5,11 48,11.5 LED23.2-DOUT | v65,7.5 71.5,7.5 72,8 LED24.4-DIN
N$21  (via drill 0.35)
  Top 0.152: v84,11 85,10 v85,8
  Bottom 0.152: v84,11 83.5,10.5 69,10.5 68,11.5 LED24.2-DOUT | v85,8 85.5,7.5 91.5,7.5 92,8 LED25.4-DIN
N$22  (via drill 0.35)
  Top 0.152: v84,12 83,11 v83,8
  Bottom 0.152: v84,12 87.5,12 LED25.2-DOUT | v83,8 84,7 111,7 112,8 LED26.4-DIN
N$23  (via drill 0.35)
  Top 0.152: v105,11.5 104,10.5 v104,5.5
  Bottom 0.152: v105,11.5 107.5,11.5 LED26.2-DOUT | v104,5.5 104.5,6 122.5,6 124,7.5 131.5,7.5 132,8 LED27.4-DIN
N$24
  Bottom 0.152: LED27.2-DOUT 128,11.5 128,9.5 151,9.5 152,8.5 LED28.4-DIN
N$25  (via drill 0.35)
  Top 0.152: v167,4.5 v169.5,7 | v156,4.5 155,5.5 v155,9
  Bottom 0.152: v169.5,7 171,7 172,8 LED29.4-DIN | v167,4.5 166.5,4 164,4 163.5,4.5 v156,4.5 | v155,9 153.5,10.5 149,10.5 148,11.5 LED28.2-DOUT
N$26
  Top 0.152: U21.2 187.5,30 181.5,24 181.5,23.5 178,23.5 178,30 175.5,32.5 168,32.5 168,32 U20.1
N$27  (via drill 0.35)
  Top 0.152: v165,12 164.5,11.5 164.5,5.5 163.5,4.5 v163.5,3.5 | v180,3 181,3 v184.5,6.5
  Bottom 0.152: v165,12 167.5,12 LED29.2-DOUT | v163.5,3.5 167.5,3.5 168,3 v180,3 | v184.5,6.5 185.5,7.5 191.5,7.5 192,8 LED30.4-DIN
N$28  (via drill 0.35)
  Top 0.152: v27.5,21 v23.5,25 | v145,5 v132.5,17.5 | v181.5,2.5 185.5,6.5 185.5,10 v186,10.5
  Bottom 0.152: v23.5,25 15.5,25 12.5,28 LED31.4-DIN | v27.5,21 31,17.5 v132.5,17.5 | v145,5 152.5,5 156,1.5 180.5,1.5 v181.5,2.5 | v186,10.5 187,11.5 187.5,11.5 LED30.2-DOUT
N$29
  Bottom 0.152: LED31.2-DOUT 8,32 8.5,32.5 25,32.5 28.5,29 31.5,29 32,28.5 LED32.4-DIN
N$30  (via drill 0.35)
  Top 0.152: v56,32.5 55.5,32 55.5,30 v54,28.5
  Bottom 0.152: v56,32.5 46.5,32.5 44.5,30.5 29,30.5 28,31.5 LED32.2-DOUT | v54,28.5 52.5,28.5 LED33.4-DIN
N$31
  Bottom 0.152: LED33.2-DOUT 48,31.5 48,29.5 71,29.5 72,28.5 LED34.4-DIN
N$32
  Bottom 0.152: LED34.2-DOUT 68,31.5 69.5,30 88.5,30 89.5,29 91.5,29 92,28.5 LED35.4-DIN
N$33
  Bottom 0.152: LED35.2-DOUT 88,31.5 88.5,31 91.5,31 92,30.5 105.5,30.5 106,31 106.5,31 108.5,29 111.5,29 112,28.5 LED36.4-DIN
N$34
  Bottom 0.152: LED36.2-DOUT 108,31.5 109.5,30 125.5,30 126,29.5 131,29.5 132,28.5 LED37.4-DIN
N$35
  Bottom 0.152: LED38.4-DIN 152,28.5 150.5,30 129.5,30 128,31.5 LED37.2-DOUT
N$36  (via drill 0.35)
  Top 0.152: v166,28.5 166,9 165,8 165,5.5 164.5,5 v164.5,2.5 | v145,6 144,7 v144,31
  Bottom 0.152: v166,28.5 167,29.5 171,29.5 172,28.5 LED39.4-DIN | v164.5,2.5 155.5,2.5 152,6 v145,6 | v144,31 144.5,31.5 147.5,31.5 LED38.2-DOUT
N$37  (via drill 0.35)
  Top 0.152: v176,31 177.5,29.5 v177.5,10.5 | v175.5,8.5 174.5,7.5 v174.5,5
  Bottom 0.152: v176,31 175.5,30.5 169,30.5 168,31.5 LED39.2-DOUT | v177.5,10.5 177.5,8.5 v175.5,8.5 | v174.5,5 175,5.5 182,5.5 187,10.5 193,10.5 193.5,11 193.5,28 192.5,28 LED40.4-DIN
N$38
  Bottom 0.152: DO1.1 188,38 188,32 LED40.2-DOUT
VBAT  (via drill 0.35)
  Top 0.152: v173.5,7 173.5,1.5 162.5,1.5 158,6 158,10.5 159.5,12 U$1.22
  Bottom 0.152: v173.5,7 173.5,11.5 179.5,11.5 180,12 U$2.22

### Text on the board
tPlace: WS2812
bPlace: SK6812